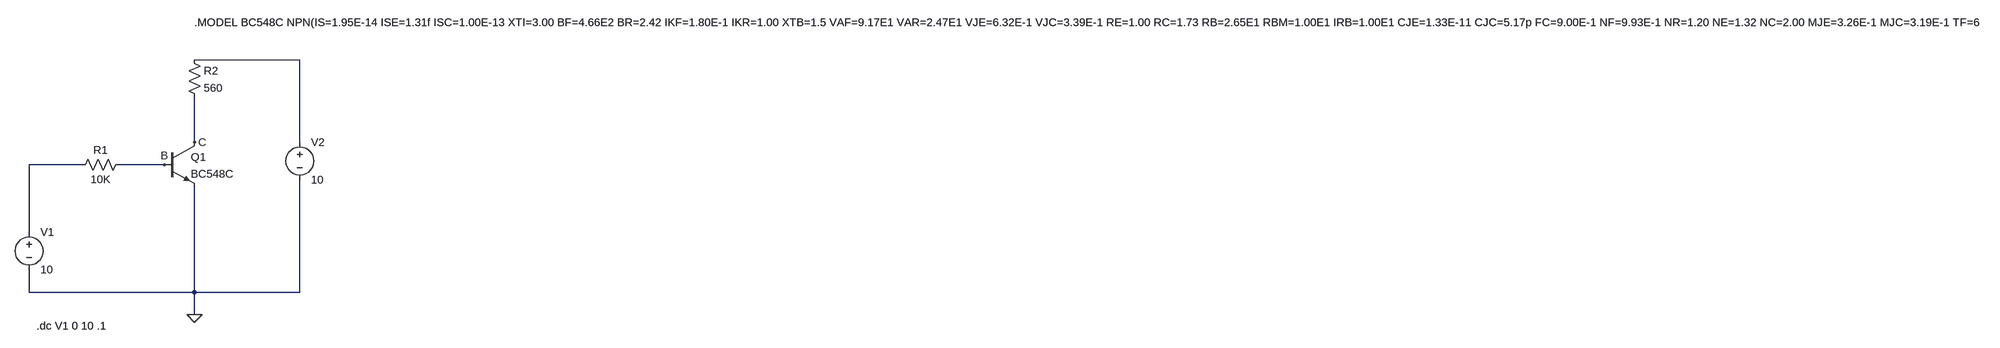
[diagram p0: schematic Polarizacion_Juntura.asc]
Polarizacion_Juntura.asc, the LTspice schematic file:
Version 4.1
SHEET 1 5660 680
WIRE 624 -112 400 -112
WIRE 400 64 400 -32
WIRE 624 64 624 -112
WIRE 160 112 48 112
WIRE 336 112 240 112
WIRE 48 256 48 112
WIRE 48 384 48 336
WIRE 400 384 400 160
WIRE 400 384 48 384
WIRE 624 384 624 144
WIRE 624 384 400 384
WIRE 400 432 400 384
FLAG 400 432 0
FLAG 336 112 B
FLAG 400 64 C
SYMBOL voltage 48 240 R0
WINDOW 123 0 0 Left 0
WINDOW 39 0 0 Left 0
SYMATTR InstName V1
SYMATTR Value 10
SYMBOL res 256 96 R90
WINDOW 0 0 56 VBottom 2
WINDOW 3 32 56 VTop 2
SYMATTR InstName R1
SYMATTR Value 10K
SYMBOL res 384 -128 R0
SYMATTR InstName R2
SYMATTR Value 560
SYMBOL voltage 624 48 R0
SYMATTR InstName V2
SYMATTR Value 10
SYMBOL npn 336 64 R0
SYMATTR InstName Q1
SYMATTR Value BC548C
TEXT 400 -192 Left 2 !.MODEL BC548C NPN(IS=1.95E-14 ISE=1.31f ISC=1.00E-13 XTI=3.00 BF=4.66E2 BR=2.42 IKF=1.80E-1 IKR=1.00 XTB=1.5 VAF=9.17E1 VAR=2.47E1 VJE=6.32E-1 VJC=3.39E-1 RE=1.00 RC=1.73 RB=2.65E1 RBM=1.00E1 IRB=1.00E1 CJE=1.33E-11 CJC=5.17p FC=9.00E-1 NF=9.93E-1 NR=1.20 NE=1.32 NC=2.00 MJE=3.26E-1 MJC=3.19E-1 TF=6.52E-10 TR=0 ITF=1.03 VTF=1.65 XTF=1.00E2 EG=1.11 VCEO=30 ICRATING=100m MFG=PHILIPS)
TEXT 64 456 Left 2 !.dc V1 0 10 .1

The netlist it stands for:
* Polarizacion_Juntura.asc
V1 N002 0 10
R1 B N002 10K
R2 N001 C 560
V2 N001 0 10
Q1 C B 0 0 BC548C
.model NPN NPN
.model PNP PNP
.lib standard.bjt
.MODEL BC548C NPN(IS=1.95E-14 ISE=1.31f ISC=1.00E-13 XTI=3.00 BF=4.66E2 BR=2.42 IKF=1.80E-1 IKR=1.00 XTB=1.5 VAF=9.17E1 VAR=2.47E1 VJE=6.32E-1 VJC=3.39E-1 RE=1.00 RC=1.73 RB=2.65E1 RBM=1.00E1 IRB=1.00E1 CJE=1.33E-11 CJC=5.17p FC=9.00E-1 NF=9.93E-1 NR=1.20 NE=1.32 NC=2.00 MJE=3.26E-1 MJC=3.19E-1 TF=6.52E-10 TR=0 ITF=1.03 VTF=1.65 XTF=1.00E2 EG=1.11 VCEO=30 ICRATING=100m MFG=PHILIPS)
.dc V1 0 10 .1
.backanno
.end